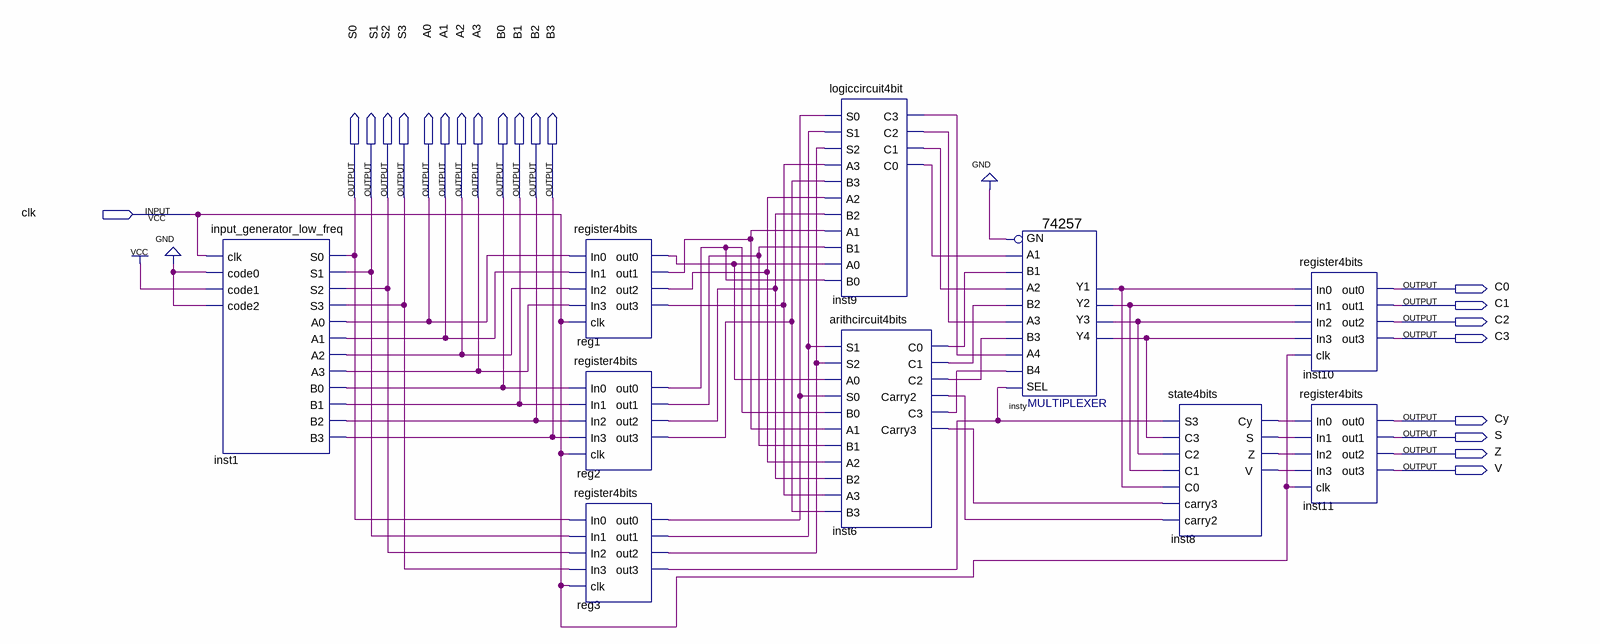
[diagram p0: schematic sheet]
// Quartus schematic Lab3top.bdf as structural Verilog: 10 symbols, 21 pins
module Lab3top (
  input  clk,
  output S0,
  output S1,
  output S2,
  output S3,
  output A0,
  output A1,
  output A2,
  output A3,
  output B0,
  output B1,
  output B2,
  output B3,
  output C0,
  output C1,
  output C2,
  output C3,
  output Cy,
  output S,
  output Z,
  output V
);

  wire inst6_c0, inst6_c1, inst6_c2, inst6_c3, inst6_carry2, inst6_carry3, inst8_cy, inst8_s, inst8_v,
       inst8_z, inst9_c0, inst9_c1, inst9_c2, inst9_c3, insty_y1, insty_y2, insty_y3, insty_y4, reg1_out0,
       reg1_out1, reg1_out2, reg1_out3, reg2_out0, reg2_out1, reg2_out2, reg2_out3, reg3_out0, reg3_out1,
       reg3_out2, reg3_out3;

  input_generator_low_freq inst1 (
    .clk(clk), .code0(1'b0), .code1(1'b1), .code2(1'b0), .S0(S0), .S1(S1), .S2(S2), .S3(S3), .A0(A0),
    .A1(A1), .A2(A2), .A3(A3), .B0(B0), .B1(B1), .B2(B2), .B3(B3));
  register4bits reg1 (
    .In0(A0), .In1(A1), .In2(A2), .In3(A3), .clk(clk), .out0(reg1_out0), .out1(reg1_out1), .out2(reg1_out2),
    .out3(reg1_out3));
  register4bits reg2 (
    .In0(B0), .In1(B1), .In2(B2), .In3(B3), .clk(clk), .out0(reg2_out0), .out1(reg2_out1), .out2(reg2_out2),
    .out3(reg2_out3));
  register4bits reg3 (
    .In0(S0), .In1(S1), .In2(S2), .In3(S3), .clk(clk), .out0(reg3_out0), .out1(reg3_out1), .out2(reg3_out2),
    .out3(reg3_out3));
  logiccircuit4bit inst9 (
    .S0(reg3_out0), .S1(reg3_out1), .S2(reg3_out2), .A3(reg1_out3), .B3(reg2_out3), .A2(reg1_out2),
    .B2(reg2_out2), .A1(reg1_out1), .B1(reg2_out1), .A0(reg1_out0), .B0(reg2_out0), .C3(inst9_c3),
    .C2(inst9_c2), .C1(inst9_c1), .C0(inst9_c0));
  arithcircuit4bits inst6 (
    .S1(reg3_out1), .S2(reg3_out2), .A0(reg1_out0), .S0(reg3_out0), .B0(reg2_out0), .A1(reg1_out1),
    .B1(reg2_out1), .A2(reg1_out2), .B2(reg2_out2), .A3(reg1_out3), .B3(reg2_out3), .C0(inst6_c0),
    .C1(inst6_c1), .C2(inst6_c2), .Carry2(inst6_carry2), .C3(inst6_c3), .Carry3(inst6_carry3));
  \74257  insty (
    .B1(inst6_c0), .A1(inst9_c0), .B3(inst6_c2), .A2(inst9_c1), .B2(inst6_c1), .A3(inst9_c2), .A4(inst9_c3),
    .B4(inst6_c3), .SEL(reg3_out3), .GN(1'b0), .Y2(insty_y2), .Y3(insty_y3), .Y4(insty_y4), .Y1(insty_y1));
  state4bits inst8 (
    .S3(reg3_out3), .C3(insty_y4), .C2(insty_y3), .C1(insty_y2), .C0(insty_y1), .carry3(inst6_carry3),
    .carry2(inst6_carry2), .Cy(inst8_cy), .S(inst8_s), .Z(inst8_z), .V(inst8_v));
  register4bits inst10 (
    .In0(insty_y1), .In1(insty_y2), .In2(insty_y3), .In3(insty_y4), .clk(clk), .out0(C0), .out1(C1),
    .out2(C2), .out3(C3));
  register4bits inst11 (
    .In0(inst8_cy), .In1(inst8_s), .In2(inst8_z), .In3(inst8_v), .clk(clk), .out0(Cy), .out1(S), .out2(Z),
    .out3(V));
endmodule
